# EAGLE schematic PCB_CAPA1 (EAGLE 9.5.1)
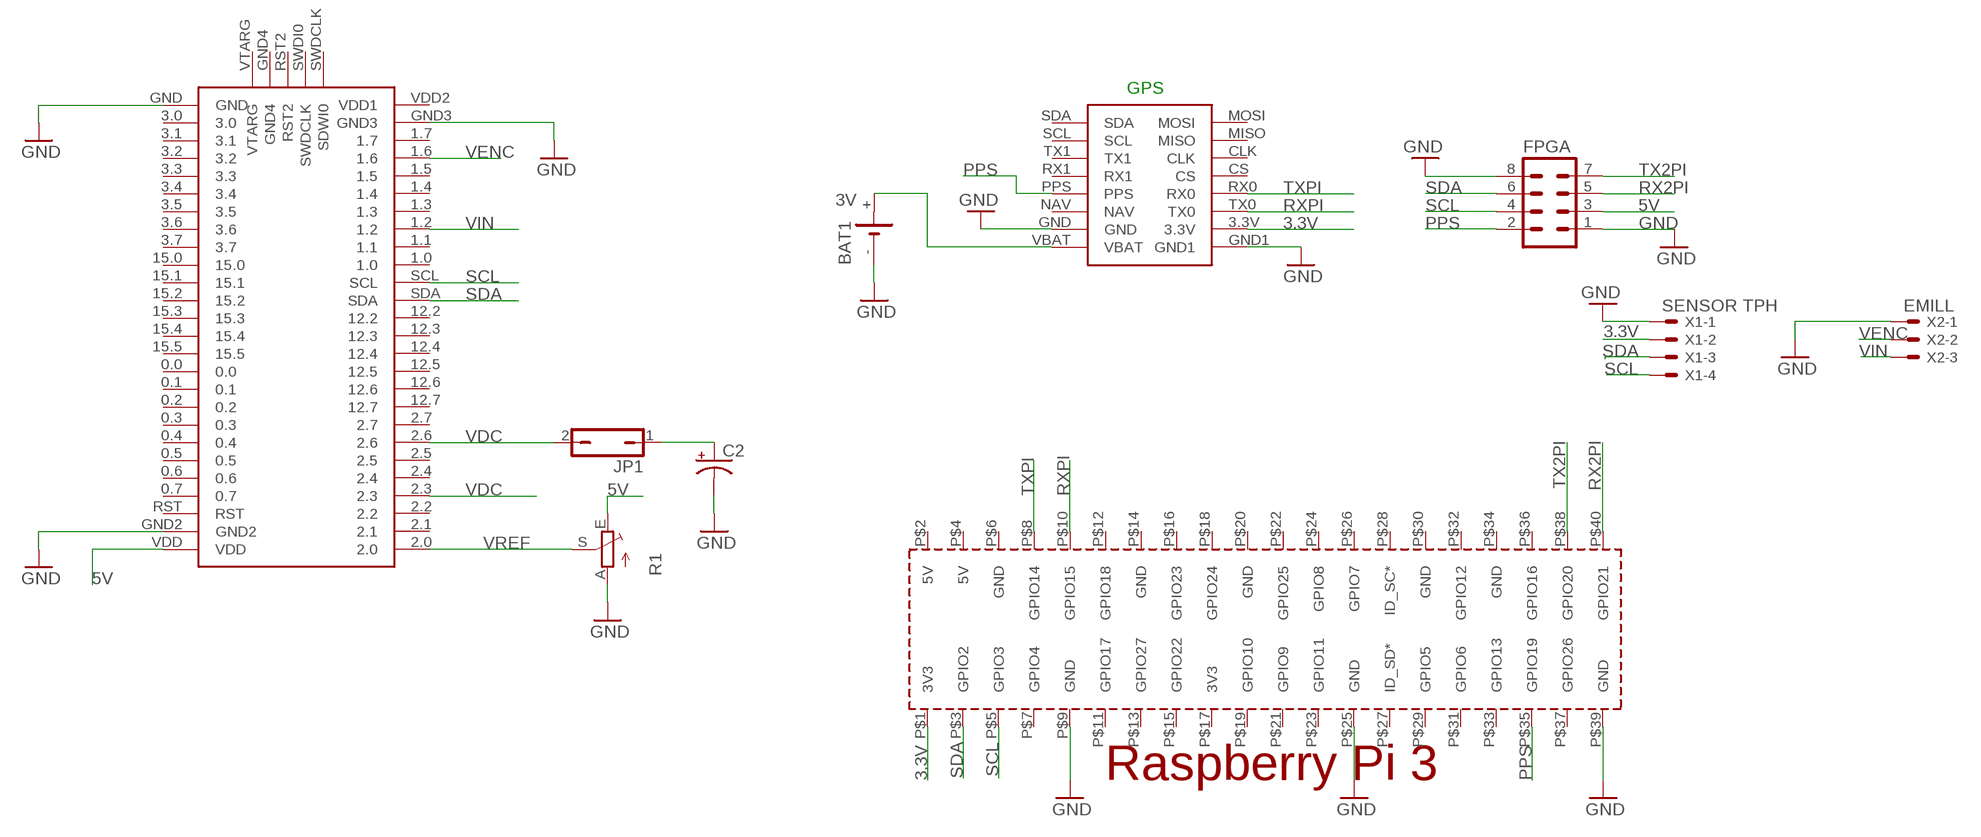
[diagram p0: schematic, sheet 1]

## Parts
BAT1  3V  CH291-1220LF  [CH291-1220LF]
C2  CPOL-US153CLV-0807  [153CLV-0807]
FPGA  MA04-2  [MA04-2]
GPS  GPS_VENUS  [GPS_VENUS]
JP1  JP1Q  [JP1]
PCB1  RPI3RPI3  [RPI3]
R1  TRIM_EU-B90P  [SP19L]
U$1  PSOC_5LP  [PSOC_5LP]
X1  SENSOR TPH  22-23-2041  [22-23-2041]
X2  EMILL  22-23-2031  [22-23-2031]

## Nets
3.3V: GPS.3.3V PCB1.P$1(3V3) X1.2
5V: FPGA.3 R1.E U$1.VDD
GND: BAT1.- C2.- FPGA.1 FPGA.8 GPS.GND GPS.GND1 PCB1.P$9(GND) PCB1.P$25(GND) PCB1.P$39(GND) R1.A U$1.GND U$1.GND2 U$1.GND3 X1.1 X2.1
N$1: BAT1.+ GPS.VBAT
N$2: C2.+ JP1.1
PPS: FPGA.2 GPS.PPS PCB1.P$35(GPIO19)
RX2PI: FPGA.5 PCB1.P$40(GPIO21)
RXPI: GPS.TX0 PCB1.P$10(GPIO15)
SCL: FPGA.4 PCB1.P$5(GPIO3) U$1.SCL X1.4
SDA: FPGA.6 PCB1.P$3(GPIO2) U$1.SDA X1.3
TX2PI: FPGA.7 PCB1.P$38(GPIO20)
TXPI: GPS.RX0 PCB1.P$8(GPIO14)
VDC: JP1.2 U$1.2.3 U$1.2.6
VENC: U$1.1.6 X2.2
VIN: U$1.1.2 X2.3
VREF: R1.S U$1.2.0
Unconnected: GPS.CLK GPS.CS GPS.MISO GPS.MOSI GPS.NAV GPS.RX1 GPS.SCL GPS.SDA GPS.TX1 PCB1.P$2(5V) PCB1.P$4(5V) PCB1.P$6(GND) PCB1.P$7(GPIO4) PCB1.P$11(GPIO17) PCB1.P$12(GPIO18) PCB1.P$13(GPIO27) PCB1.P$14(GND) PCB1.P$15(GPIO22) PCB1.P$16(GPIO23) PCB1.P$17(3V3) PCB1.P$18(GPIO24) PCB1.P$19(GPIO10) PCB1.P$20(GND) PCB1.P$21(GPIO9) PCB1.P$22(GPIO25) PCB1.P$23(GPIO11) PCB1.P$24(GPIO8) PCB1.P$26(GPIO7) PCB1.P$27(ID_SD*) PCB1.P$28(ID_SC*) PCB1.P$29(GPIO5) PCB1.P$30(GND) PCB1.P$31(GPIO6) PCB1.P$32(GPIO12) PCB1.P$33(GPIO13) PCB1.P$34(GND) PCB1.P$36(GPIO16) PCB1.P$37(GPIO26) U$1.0.0 U$1.0.1 U$1.0.2 U$1.0.3 U$1.0.4 U$1.0.5 U$1.0.6 U$1.0.7 U$1.1.0 U$1.1.1 U$1.1.3 U$1.1.4 U$1.1.5 U$1.1.7 U$1.2.1 U$1.2.2 U$1.2.4 U$1.2.5 U$1.2.7 U$1.3.0 U$1.3.1 U$1.3.2 U$1.3.3 U$1.3.4 U$1.3.5 U$1.3.6 U$1.3.7 U$1.12.2 U$1.12.3 U$1.12.4 U$1.12.5 U$1.12.6 U$1.12.7 U$1.15.0 U$1.15.1 U$1.15.2 U$1.15.3 U$1.15.4 U$1.15.5 U$1.GND4 U$1.RST U$1.RST2 U$1.SWDCLK(SDWI0) U$1.SWDI0(SWDCLK) U$1.VDD2(VDD1) U$1.VTARG

## Notes on the sheet
- GPS

## Library data of the parts
BAT1 = battery:CH291-1220LF: Battery Holder, SMT, 12mm multicomp PART NO. CH291-1220LF Source: Data sheet <http://www.farnell.com/datasheets/1505860.pdf>
C2 = rcl:CPOL-US: POLARIZED CAPACITOR, American symbol; SPICEPREFIX: C
FPGA = con-lstb_v2:MA04-2: PIN HEADER; OC_FARNELL: unknown; OC_NEWARK: unknown
GPS = GPS_VENUS:GPS_VENUS
JP1 = jumper:JP1Q: JUMPER
PCB1 = RP3B:RPI3: Device for Raspberry Pi 3 board created by Dave Young for www.element14.com More information and support community is available at https://www.element14.com/community/community/raspberry-pi Device for Raspberry Pi 3 board updated by Gerald Schwarz for www.element14.com On RPI3 addet the layer milling and created a mirrored shield.
R1 = pot:TRIM_EU-: POTENTIOMETER
U$1 = PSOC_5LP:PSOC_5LP
X1 = con-molex:22-23-2041: .100" (2.54mm) Center Header - 4 Pin; MF: MOLEX; MPN: 22-23-2041; OC_FARNELL: 1462920; OC_NEWARK: 38C0355
X2 = con-molex:22-23-2031: .100" (2.54mm) Center Header - 3 Pin; MF: MOLEX; MPN: 22-23-2031; OC_FARNELL: 1462950; OC_NEWARK: 30C0862